# Altium schematic sheet Special_Equipment_Cabinet_Overview.SchDoc: <Document>
size Letter; Engineer: <Engineer>; Organization: UPEL; Address1: USU Power Electronics Lab; Address2: USTAR Building 620, RM 118; Address3: 1600 N 620 E; Address4: North Logan, UT 84341; DocumentNumber: 2; Revision: v1; SheetNumber: 2; SheetTotal: 16; ProjectName: <Project>
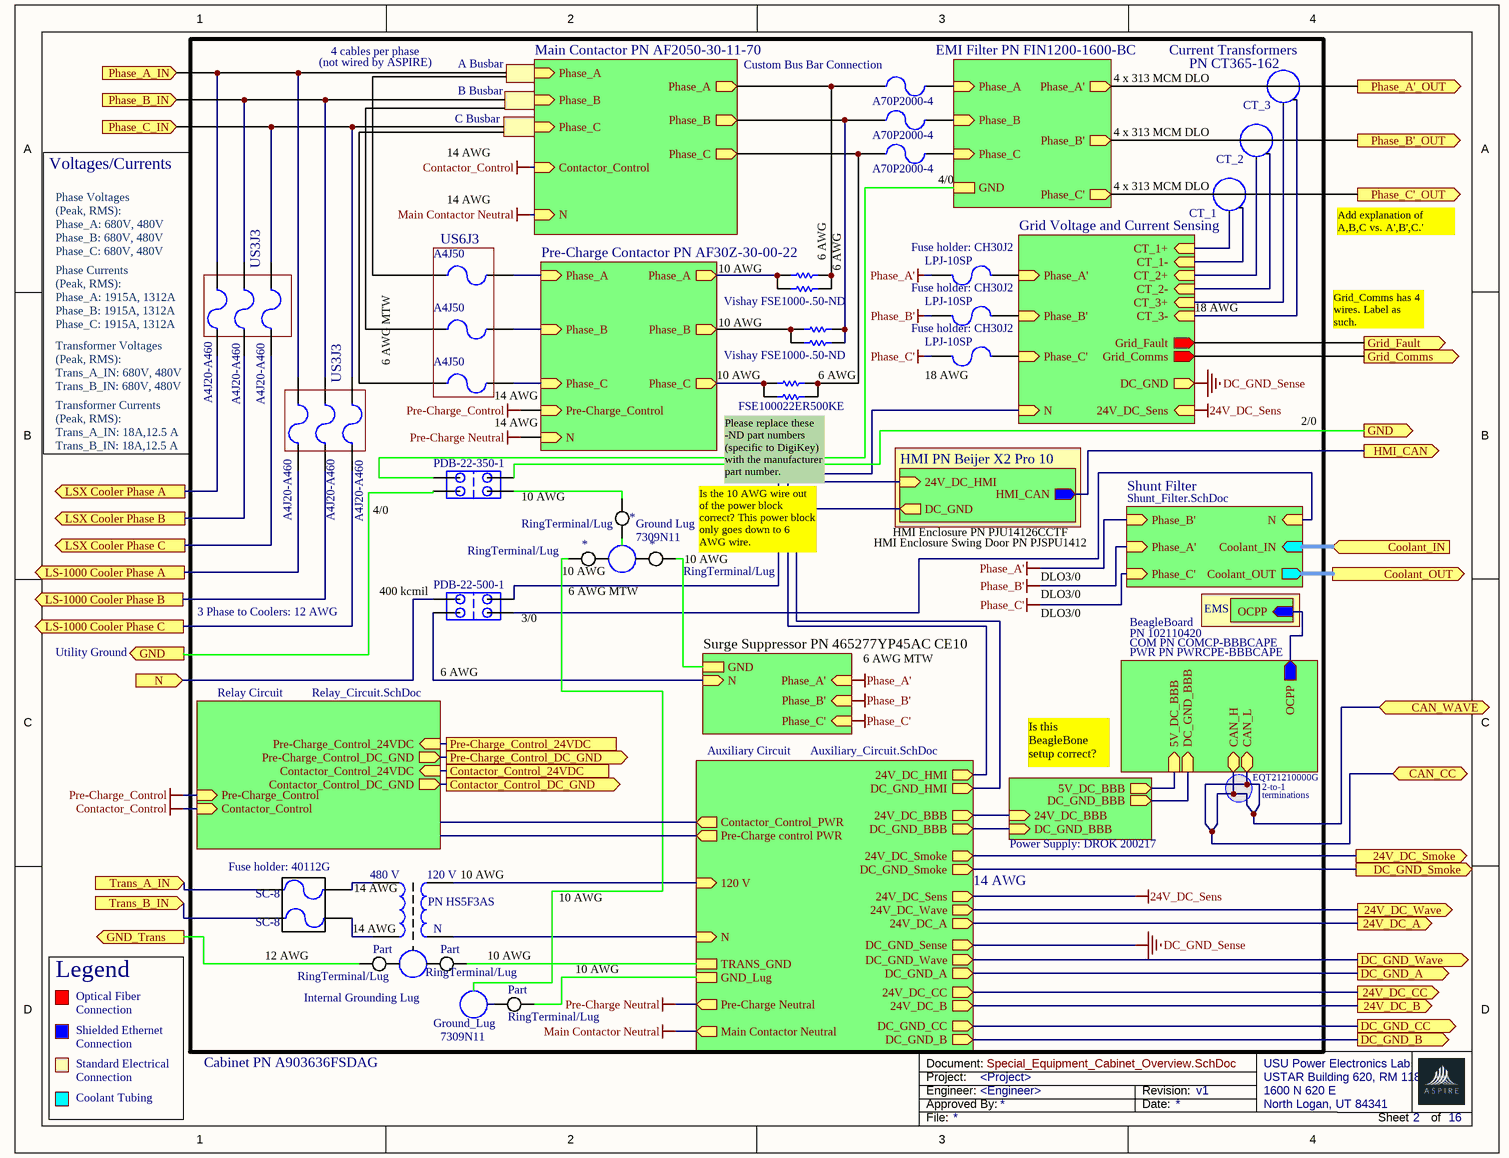
[diagram p0: Special_Equipment_Cabinet_Overview.SchDoc]

## Parts
(Parts that share a designator on the sheet are numbered #1, #2 ... from top to bottom, then left to right.)
7309N11#1  Ground_Lug_Three_Pin  (value not drawn)
7309N11#2  Ground_Lug_Three_Pin  (value not drawn)
7309N11#3  Ground_Lug
*#1  CT_3
*#2  CT_2
*#3  CT_1
*#4  RingTerminal/Lug
*#5  RingTerminal/Lug
*#6  RingTerminal/Lug
F64  A70P2000-4  [PIN-W2/E2.8]
F65  A70P2000-4  [PIN-W2/E2.8]
F66  A70P2000-4  [PIN-W2/E2.8]
F67  A4J50  [PIN-W2/E2.8]
F68  Fuse 2  [PIN-W2/E2.8]  (value not drawn)
F69  A4J50  [PIN-W2/E2.8]
F70  Fuse 2  [PIN-W2/E2.8]  (value not drawn)
F71  A4J50  [PIN-W2/E2.8]
F72  Fuse 2  [PIN-W2/E2.8]  (value not drawn)
F?#1  A4J20-A460  [PIN-W2/E2.8]
F?#2  A4J20-A460  [PIN-W2/E2.8]
F?#3  A4J20-A460  [PIN-W2/E2.8]
F?#4  A4J20-A460  [PIN-W2/E2.8]
F?#5  A4J20-A460  [PIN-W2/E2.8]
F?#6  A4J20-A460  [PIN-W2/E2.8]
FSE100022ER500KE  Res1  [AXIAL-0.3]  (value not drawn)
J16  PDB-22-350-1
J17  PDB-22-500-1
Part#1  RingTerminal/Lug
Part#2  RingTerminal/Lug
Part#3  RingTerminal/Lug
SC-8#1  Fuse 2  [PIN-W2/E2.8]  (value not drawn)
SC-8#2  Fuse 2  [PIN-W2/E2.8]  (value not drawn)
T1  PN HS5F3AS  [TRANS]
Vishay_FSE1  Res1  [AXIAL-0.3]  (value not drawn)
Vishay_FSE2  Res1  [AXIAL-0.3]  (value not drawn)
Vishay_FSE3  Res1  [AXIAL-0.3]  (value not drawn)
Vishay_FSE1000-.50-ND#1  Res1  [AXIAL-0.3]  (value not drawn)
Vishay_FSE1000-.50-ND#2  Res1  [AXIAL-0.3]  (value not drawn)

## Blocks framed on the sheet
US6J3: F67 F69 F71
US3J3: F?#1-F?#3
US3J3: F?#4-F?#6

## Sub-sheets
Auxiliary Circuit = Auxiliary_Circuit.SchDoc: 24V_DC_A (out), DC_GND_B (out), DC_GND_CC (out), 24V_DC_Wave (out), DC_GND_Wave (out), DC_GND_A (out), 24V_DC_CC (out), 24V_DC_B (out), 24V_DC_Sens (out), DC_GND_Sense (out), Pre-Charge Neutral (out), Main Contactor Neutral (out), 120 V (in), N (in), Contactor_Control_PWR (out), Pre-Charge control PWR (out), DC_GND_Smoke (out), 24V_DC_Smoke (out), TRANS_GND, GND_Lug, 24V_DC_HMI (out), DC_GND_HMI (out), 24V_DC_BBB (out), DC_GND_BBB (out)
BeagleBoard = File Name: OCPP (out), CAN_H (bidir), CAN_L (bidir), 5V_DC_BBB (in), DC_GND_BBB (in)
EMI Filter PN FIN1200-1600-BC = File Name: Phase_A (in), Phase_B (in), Phase_C (in), Phase_C' (out), Phase_B' (out), Phase_A' (out), GND
EMS = File Name: OCPP (in)
Grid Voltage and Current Sensing = File Name: Phase_A' (in), Phase_B' (in), Phase_C' (in), N (in), Grid_Comms (out), Grid_Fault (out), 24V_DC_Sens (in), CT_1+ (in), CT_3+ (in), CT_2+ (in), DC_GND (out), CT_1- (in), CT_2- (in), CT_3- (in)
HMI PN Beijer X2 Pro 10 = File Name: 24V_DC_HMI (in), HMI_CAN (out), DC_GND (out)
Main Contactor PN AF2050-30-11-70 = File Name: Phase_A (in), Phase_B (in), Phase_C (in), N (in), Contactor_Control (in), Phase_A (out), Phase_B (out), Phase_C (out)
Power Supply: DROK 200217 = File Name: 5V_DC_BBB (out), DC_GND_BBB (out), 24V_DC_BBB (in), DC_GND_BBB (in)
Pre-Charge Contactor PN AF30Z-30-00-22 = File Name: Phase_B (in), Phase_C (in), Phase_A (out), Phase_B (out), Phase_C (out), Phase_A (in), Pre-Charge_Control (in), N (in)
Relay Circuit = Relay_Circuit.SchDoc: Contactor_Control_24VDC (in), Pre-Charge_Control_DC_GND (out), Pre-Charge_Control (in), Pre-Charge_Control_24VDC (in), Contactor_Control (in), Contactor_Control_DC_GND (out)
Shunt Filter = Shunt_Filter.SchDoc: Phase_B' (in), Phase_A' (in), Phase_C' (in), N (in), Coolant_IN (in), Coolant_OUT (out)
Surge Suppressor PN 465277YP45AC CE10 = File Name: Phase_A' (in), Phase_B' (in), Phase_C' (in), N (in), GND

## Ports
24V_DC_A (out), 24V_DC_B (out), 24V_DC_CC (out), 24V_DC_Smoke (out), 24V_DC_Wave (out), CAN_CC (bidir), CAN_WAVE (bidir), Contactor_Control_24VDC, Contactor_Control_DC_GND (out), Coolant_IN (in), Coolant_OUT (out), DC_GND_A (out), DC_GND_B (out), DC_GND_CC (out), DC_GND_Smoke (out), DC_GND_Wave (out), GND (out), GND_Trans (out), Grid_Comms (out), Grid_Fault (out), HMI_CAN (out), LS-1000 Cooler Phase A (out), LS-1000 Cooler Phase B (out), LS-1000 Cooler Phase C (out), LSX Cooler Phase A (out), LSX Cooler Phase B (out), LSX Cooler Phase C (out), N (in), Phase_A'_OUT (out), Phase_A_IN (in), Phase_B'_OUT (out), Phase_B_IN (in), Phase_C'_OUT (out), Phase_C_IN (in), Pre-Charge_Control_24VDC, Pre-Charge_Control_DC_GND (out), Trans_A_IN (in), Trans_B_IN (in)

## Nets
24V_DC_Sens: sheet Grid Voltage and Current Sensing/24V_DC_Sens, sheet Auxiliary Circuit/24V_DC_Sens
Contactor_Control: sheet Main Contactor PN AF2050-30-11-70/Contactor_Control, sheet Relay Circuit/Contactor_Control
DC_GND_Sense: sheet Grid Voltage and Current Sensing/DC_GND, sheet Auxiliary Circuit/DC_GND_Sense
Main Contactor Neutral: sheet Main Contactor PN AF2050-30-11-70/N, sheet Auxiliary Circuit/Main Contactor Neutral
Phase_A': F68.2 ; sheet Surge Suppressor PN 465277YP45AC CE10/Phase_A', sheet Shunt Filter/Phase_B'
Phase_B': F70.2 ; sheet Surge Suppressor PN 465277YP45AC CE10/Phase_B', sheet Shunt Filter/Phase_A'
Phase_C': F72.2 ; sheet Surge Suppressor PN 465277YP45AC CE10/Phase_C', sheet Shunt Filter/Phase_C'
Pre-Charge Neutral: sheet Pre-Charge Contactor PN AF30Z-30-00-22/N, sheet Auxiliary Circuit/Pre-Charge Neutral
Pre-Charge_Control: sheet Pre-Charge Contactor PN AF30Z-30-00-22/Pre-Charge_Control, sheet Relay Circuit/Pre-Charge_Control
24V_DC_A: port 24V_DC_A, sheet Auxiliary Circuit/24V_DC_A
24V_DC_B: port 24V_DC_B, sheet Auxiliary Circuit/24V_DC_B
24V_DC_CC: port 24V_DC_CC, sheet Auxiliary Circuit/24V_DC_CC
24V_DC_Smoke: port 24V_DC_Smoke, sheet Auxiliary Circuit/24V_DC_Smoke
24V_DC_Wave: port 24V_DC_Wave, sheet Auxiliary Circuit/24V_DC_Wave
CAN_CC: port CAN_WAVE, port CAN_CC, sheet BeagleBoard/CAN_H, sheet BeagleBoard/CAN_L
Contactor_Control_24VDC: port Contactor_Control_24VDC, sheet Relay Circuit/Contactor_Control_24VDC
Contactor_Control_DC_GND: port Contactor_Control_DC_GND, sheet Relay Circuit/Contactor_Control_DC_GND
Coolant_IN: port Coolant_IN, sheet Shunt Filter/Coolant_IN
Coolant_OUT: port Coolant_OUT, sheet Shunt Filter/Coolant_OUT
DC_GND_A: port DC_GND_A, sheet Auxiliary Circuit/DC_GND_A
DC_GND_B: port DC_GND_B, sheet Auxiliary Circuit/DC_GND_B
DC_GND_CC: port DC_GND_CC, sheet Auxiliary Circuit/DC_GND_CC
DC_GND_Smoke: port DC_GND_Smoke, sheet Auxiliary Circuit/DC_GND_Smoke
DC_GND_Wave: port DC_GND_Wave, sheet Auxiliary Circuit/DC_GND_Wave
GND: J16.2 J16.4 ; port GND
GND_Trans: Part#1.2_13 ; port GND_Trans
Grid_Comms: port Grid_Comms, sheet Grid Voltage and Current Sensing/Grid_Comms
Grid_Fault: port Grid_Fault, sheet Grid Voltage and Current Sensing/Grid_Fault
HMI_CAN: port HMI_CAN, sheet HMI PN Beijer X2 Pro 10/HMI_CAN
LS-1000 Cooler Phase A: F?#4.1 ; port LS-1000 Cooler Phase A
LS-1000 Cooler Phase B: F?#5.1 ; port LS-1000 Cooler Phase B
LS-1000 Cooler Phase C: F?#6.1 ; port LS-1000 Cooler Phase C
LSX Cooler Phase A: F?#1.1 ; port LSX Cooler Phase A
LSX Cooler Phase B: F?#2.1 ; port LSX Cooler Phase B
LSX Cooler Phase C: F?#3.1 ; port LSX Cooler Phase C
N: J17.4 ; port N
Phase_A'_OUT: port Phase_A'_OUT, sheet EMI Filter PN FIN1200-1600-BC/Phase_A'
Phase_A_IN: F?#1.2 F?#4.2 ; port Phase_A_IN
Phase_B'_OUT: port Phase_B'_OUT, sheet EMI Filter PN FIN1200-1600-BC/Phase_B'
Phase_B_IN: F?#2.2 F?#5.2 ; port Phase_B_IN
Phase_C'_OUT: port Phase_C'_OUT, sheet EMI Filter PN FIN1200-1600-BC/Phase_C'
Phase_C_IN: F?#3.2 F?#6.2 ; port Phase_C_IN
Pre-Charge_Control_24VDC: port Pre-Charge_Control_24VDC, sheet Relay Circuit/Pre-Charge_Control_24VDC
Pre-Charge_Control_DC_GND: port Pre-Charge_Control_DC_GND, sheet Relay Circuit/Pre-Charge_Control_DC_GND
Trans_A_IN: SC-8#1.1 ; port Trans_A_IN
Trans_B_IN: SC-8#2.1 ; port Trans_B_IN
Net7309N11#1_5: 7309N11#1.5 *#4.2_12
Net7309N11#1_5: 7309N11#1.5 *#6.2_13  [a separate net that carries the same name]
Net7309N11#1_5: 7309N11#1.5 *#5.2_12  [a separate net that carries the same name]
Net7309N11#2_5: 7309N11#2.5 Part#2.2_13
Net7309N11#2_5: 7309N11#2.5 Part#1.2_12  [a separate net that carries the same name]
Net7309N11#3_5: 7309N11#3.5 *#5.2_13
Net7309N11#3_5: 7309N11#3.5 Part#3.2_13  [a separate net that carries the same name]
Net*#1_4: *#1.4 ; sheet Grid Voltage and Current Sensing/CT_3+
Net*#1_4: *#1.4 ; sheet Grid Voltage and Current Sensing/CT_3-  [a separate net that carries the same name]
Net*#2_4: *#2.4 ; sheet Grid Voltage and Current Sensing/CT_2+
Net*#2_4: *#2.4 ; sheet Grid Voltage and Current Sensing/CT_2-  [a separate net that carries the same name]
Net*#3_4: *#3.4 ; sheet Grid Voltage and Current Sensing/CT_1+
Net*#3_4: *#3.4 ; sheet Grid Voltage and Current Sensing/CT_1-  [a separate net that carries the same name]
Net*#4_2_13: *#4.2_13 J16.1
Net*#6_2_12: *#6.2_12 ; sheet Surge Suppressor PN 465277YP45AC CE10/GND
NetF64_1: F64.1 Vishay_FSE1.2 Vishay_FSE1000-.50-ND#1.2 ; sheet Main Contactor PN AF2050-30-11-70/Phase_A
NetF64_2: F64.2 ; sheet EMI Filter PN FIN1200-1600-BC/Phase_A
NetF65_1: F65.1 Vishay_FSE2.2 Vishay_FSE1000-.50-ND#2.2 ; sheet Main Contactor PN AF2050-30-11-70/Phase_B
NetF65_2: F65.2 ; sheet EMI Filter PN FIN1200-1600-BC/Phase_B
NetF66_1: F66.1 FSE100022ER500KE.2 Vishay_FSE3.2 ; sheet Main Contactor PN AF2050-30-11-70/Phase_C
NetF66_2: F66.2 ; sheet EMI Filter PN FIN1200-1600-BC/Phase_C
NetF67_2: F67.2 ; sheet Pre-Charge Contactor PN AF30Z-30-00-22/Phase_A
NetF68_1: F68.1 ; sheet Grid Voltage and Current Sensing/Phase_A'
NetF69_2: F69.2 ; sheet Pre-Charge Contactor PN AF30Z-30-00-22/Phase_B
NetF70_1: F70.1 ; sheet Grid Voltage and Current Sensing/Phase_B'
NetF71_2: F71.2 ; sheet Pre-Charge Contactor PN AF30Z-30-00-22/Phase_C
NetF72_1: F72.1 ; sheet Grid Voltage and Current Sensing/Phase_C'
NetFSE100022ER500KE_1: FSE100022ER500KE.1 Vishay_FSE3.1 ; sheet Pre-Charge Contactor PN AF30Z-30-00-22/Phase_C
NetJ16_4: J16.4 ; sheet EMI Filter PN FIN1200-1600-BC/GND
NetJ17_1: J17.1 ; sheet Shunt Filter/N
NetJ17_2: J17.2 ; sheet Grid Voltage and Current Sensing/N
NetJ17_4: J17.4 ; sheet Surge Suppressor PN 465277YP45AC CE10/N
NetPart#2_2_12: Part#2.2_12 ; sheet Auxiliary Circuit/TRANS_GND
NetPart#3_2_12: Part#3.2_12 ; sheet Auxiliary Circuit/GND_Lug
NetSC-8#1_2: SC-8#1.2 T1.1
NetSC-8#2_2: SC-8#2.2 T1.2
NetT1_3: T1.3 ; sheet Auxiliary Circuit/120 V
NetT1_4: T1.4 ; sheet Auxiliary Circuit/N
NetVishay_FSE1_1: Vishay_FSE1.1 Vishay_FSE1000-.50-ND#1.1 ; sheet Pre-Charge Contactor PN AF30Z-30-00-22/Phase_A
NetVishay_FSE2_1: Vishay_FSE2.1 Vishay_FSE1000-.50-ND#2.1 ; sheet Pre-Charge Contactor PN AF30Z-30-00-22/Phase_B
(unnamed): sheet HMI PN Beijer X2 Pro 10/24V_DC_HMI, sheet Auxiliary Circuit/24V_DC_HMI
(unnamed): sheet HMI PN Beijer X2 Pro 10/DC_GND, sheet Auxiliary Circuit/DC_GND_HMI
(unnamed): sheet Auxiliary Circuit/24V_DC_BBB, sheet Power Supply: DROK 200217/24V_DC_BBB
(unnamed): sheet Auxiliary Circuit/DC_GND_BBB, sheet Power Supply: DROK 200217/DC_GND_BBB
(unnamed): sheet BeagleBoard/OCPP, sheet EMS/OCPP
(unnamed): sheet BeagleBoard/5V_DC_BBB, sheet Power Supply: DROK 200217/5V_DC_BBB
(unnamed): sheet BeagleBoard/DC_GND_BBB, sheet Power Supply: DROK 200217/DC_GND_BBB

Not connected (* = marked no-connect by the designer): F67 1; F69 1; F71 1

## Notes on the sheet
- (not wired by ASPIRE)
- 4 cables per phase
- B Busbar
- A Busbar
- (near F64) Custom Bus Bar Connection
- 4 x 313 MCM DLO
- (near *#1) Current Transformers
- (near *#1) PN CT365-162
- 14 AWG
- C Busbar
- (near *#2) 4 x 313 MCM DLO
- Voltages/Currents
- (near F66) 4/0
- (near *#3) 4 x 313 MCM DLO
- Add explanation of A,B,C vs. A',B',C.'
- Phase Voltages
  (Peak, RMS):
  Phase_A: 680V, 480V
  Phase_B: 680V, 480V
  Phase_C: 680V, 480V
- 10 AWG
- (near Vishay_FSE1000-.50-ND#1) 6 AWG
- 6 AWG
- (near F68) Fuse holder: CH30J2
- (near F68) LPJ-10SP
- (near F?#1) Phase Currents
  (Peak, RMS):
  Phase_A: 1915A, 1312A
  Phase_B: 1915A, 1312A
  Phase_C: 1915A, 1312A
- 6 AWG MTW
- (near F70) Fuse holder: CH30J2
- (near F70) LPJ-10SP
- (near F72) LPJ-10SP
- 18 AWG
- Grid_Comms has 4 wires. Label as such.
- (near F?#1) Transformer Voltages
  (Peak, RMS):
  Trans_A_IN: 680V, 480V
  Trans_B_IN: 680V, 480V
- (near F71) 14 AWG
- (near F72) 18 AWG
- 2/0
- Transformer Currents
  (Peak, RMS):
  Trans_A_IN: 18A,12.5 A
  Trans_B_IN: 18A,12.5 A
- (near J16) 10 AWG
- Please replace these -ND part numbers (specific to DigiKey) with the manufacturer part number.
- 4/0
- Ground Lug
- (near *#6) 10 AWG
- Is the 10 AWG wire out of the power block correct? This power block only goes down to 6 AWG wire.
- HMI Enclosure PN PJU14126CCTF
- HMI Enclosure Swing Door PN PJSPU1412
- 3 Phase to Coolers: 12 AWG
- (near J17) 400 kcmil
- (near J17) 3/0
- DLO3/0
- PN 102110420
- Utility Ground
- COM PN COMCP-BBBCAPE
- PWR PN PWRCPE-BBBCAPE
- Is this BeagleBone setup correct?
- EQT21210000G
- 2-to-1
- terminations
- (near SC-8#1) Fuse holder: 40112G
- (near T1) 14 AWG
- (near T1) 480 V
- (near T1) 120 V
- (near T1) 10 AWG
- (near SC-8#2) 12 AWG
- N
- Legend
- Optical Fiber
- Shielded Ethernet
- Connection
- Internal Grounding Lug
- Standard Electrical
- Coolant Tubing
- Cabinet PN A903636FSDAG
- Project:
- Engineer:
- Document:
- Approved By:
- Date:
- Revision:
- File:
- Sheet
- of

## Library data of the parts
*#1-*#3 = CT
F64-F72 F?#1-F?#6 SC-8#1 SC-8#2 = Fuse 2: Fuse; Published: 8-Jun-2000; LatestRevisionDate: 17-Jul-2002; LatestRevisionNote: Re-released for DXP Platform.; PackageReference: PIN-W2/E2.8; Publisher: Altium Limited; PackageDescription: Thru-Hole; 2 Leads
FSE100022ER500KE Vishay_FSE1 Vishay_FSE2 Vishay_FSE1000-.50-ND#1 Vishay_FSE1000-.50-ND#2 = Res1: Resistor; Value: 1K; Published: 8-Jun-2000; LatestRevisionDate: 17-Jul-2002; LatestRevisionNote: Re-released for DXP Platform.; PackageReference: AXIAL-0.3; Publisher: Altium Limited; PackageDescription: Axial Device, Thru-Hole; 2 Leads; 0.3 in Pin Spacing
J17 = PDB-22-350-1
T1 = Trans: Transformer; Published: 24-Mar-1999; LatestRevisionDate: 08-Jul-2005; LatestRevisionNote: Mech Layer 1 removed.; PackageReference: TRANS; Publisher: Altium Limited; PackageDescription: Transformer; 4 Leads
Vishay_FSE3 = Res1: Resistor; Value: 1K; MFN: FSE100022ER500KE; Published: 8-Jun-2000; LatestRevisionDate: 17-Jul-2002; LatestRevisionNote: Re-released for DXP Platform.; PackageReference: AXIAL-0.3; Publisher: Altium Limited; PackageDescription: Axial Device, Thru-Hole; 2 Leads; 0.3 in Pin Spacing